# Altium schematic sheet can.SchDoc: MJVESC MINI - CAN
size A4; Author: Dongil Choi; Organization: DRC LAB, Myongji University; Address1: Engineering Building 1, #214; Address2: 116 Myongji-ro, Cheoin-Gu; Address3: Yongin-si, Gyeonggi-Do; Address4: South Korea, 17058; DocumentNumber: 3; Revision: 0.3A; SheetNumber: 3; SheetTotal: 3
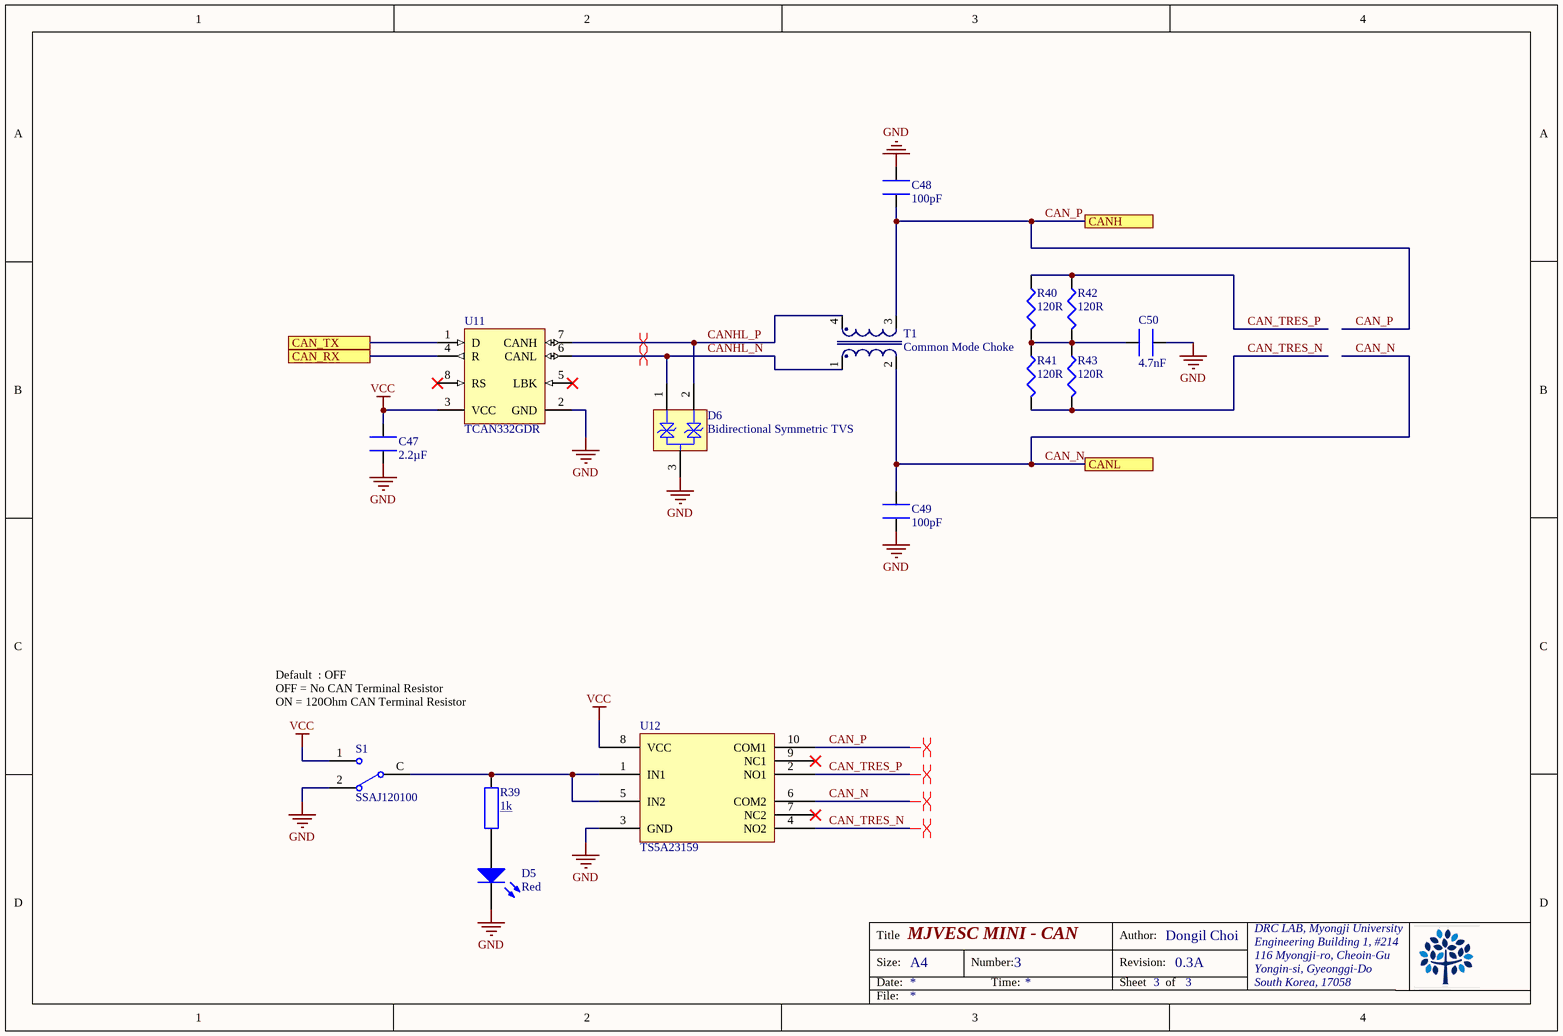
[diagram p0: can.SchDoc]

## Parts
C47  2.2µF  [CAP 0603/1608]
C48  100pF  [CAP 0402/1005]
C49  100pF  [CAP 0402/1005]
C50  4.7nF  [CAP 0603/1608]
D5  Red  [LED 0603/1608 RED]
D6  Bidirectional Symmetric TVS  [SOT23-3L]
R39  1k  [RES 0603/1608]
R40  120R  [RES 0603/1608]
R41  120R  [RES 0603/1608]
R42  120R  [RES 0603/1608]
R43  120R  [RES 0603/1608]
S1  SSAJ120100  [SSAJ120100]
T1  Common Mode Choke  [SRF4532-101Y]
U11  TCAN332GDR  [D0008A_N]
U12  TS5A23159  [RSE10]

## Ports
CAN_RX, CAN_TX, CANH, CANL

## Nets
GND: C47.1 C48.1 C49.2 C50.2 D5.2(K) D6.3(C) S1.2 U11.2(GND) U12.3(GND)
VCC: C47.2 S1.1 U11.3(VCC) U12.8(VCC)
CAN_N: C49.1 T1.2 U12.6(COM2) ; port CANL
CAN_P: C48.2 T1.3 U12.10(COM1) ; port CANH
CAN_RX: U11.4(R) ; port CAN_RX
CAN_TRES_N: R41.2 R43.2 U12.4(NO2)
CAN_TRES_P: R40.1 R42.1 U12.2(NO1)
CAN_TX: U11.1(D) ; port CAN_TX
CANHL_N: D6.1(C) T1.1 U11.6(CANL)
CANHL_P: D6.2(C) T1.4 U11.7(CANH)
NetC50_1: C50.1 R40.2 R41.1 R42.2 R43.1
NetD5_1: D5.1(A) R39.2
NetR39_1: R39.1 S1.C U12.1(IN1) U12.5(IN2)

Not connected (* = marked no-connect by the designer): U11 5(LBK)* 8(RS)*; U12 7(NC2)* 9(NC1)*

## Layout directives
differential pair: CAN_N, CAN_P, CAN_TRES_N, CAN_TRES_P, CANHL_N, CANHL_P

## Notes on the sheet
- Default  : OFF
  OFF = No CAN Terminal Resistor
  ON = 120Ohm CAN Terminal Resistor
- Title
- Size:
- Date:
- A4
- Number:
- Time:
- Revision:
- Sheet
- Author:
- of
- File:

## Library data of the parts
C47 = GRM188R61C225KE15D: CAP CER 2.2UF 16V X5R 0603; Manufacturer: Murata Electronics North America; Tolerance: ±10%; Supplier 1: Digi-Key; Supplier Part Number 1: 490-3296-1-ND; Manufacturer Part Number: GRM188R61C225KE15D; RoHS: RoHS Compliant; Category: Capacitors; Stock 1: 1255740; Pricing 1: 1=0.12, 10=0.08, 50=0.046, 100=0.038, 250=0.032, 500=0.0268, 1000=0.022 (USD); Packaging: Cut Tape (CT); Capacitance: 2.2µF; Voltage - Rated: 16V; Temperature Coefficient: X5R; Mounting Type: Surface Mount, MLCC; Operating Temperature: -55°C ~ 85°C; Applications: General Purpose; Ratings: -; Package / Case: 0603 (1608 Metric); Size / Dimension: 0.063" L x 0.031" W (1.60mm x 0.80mm); Height - Seated (Max): -; Thickness (Max): 0.035" (0.90mm); Lead Spacing: -; Features: -; Lead Style: -; ComponentLink1URL: http://www.murata.com/~/media/webrenewal/support/library/catalog/products/capacitor/mlcc/c02e.pdf; ComponentLink1Description: http://www.murata.com/~/media/webrenewal/support/library/catalog/products/capacitor/mlcc/c02e.pdf; PartNumber: GRM188R61C225KE15D
C48 C49 = GRM1885C1H222JA01D: CAP CER 100pF 50V NP0 0402; PartNumber: GRM1555C1H101GA01D
C50 = GRM1885C1H222JA01D: CAP CER 4.7nF 50V NP0 0603; PartNumber: GRM1887U1H472JA01D
D5 = LED0: Typical INFRARED GaAs LED; PartNumber: LTST-C191KRKT; Published: 8-Jun-2000; LatestRevisionDate: 08-Jul-2005; LatestRevisionNote: Mech Layer 1 removed.; PackageReference: LED-0; Publisher: Altium Limited; PackageDescription: LED; 2 Leads
D6 = ESD8V0L2B-03L: Bi-directional Low Capacitance TVS Diode, -55 to 125 degC, TSLP-3-1, Reel, Green; PartNumber: VCAN26A2-03S-E3-08
R39 = RC0603FR-071KL: RES SMD 1K OHM 1% 1/10W 0603; Manufacturer: Yageo; Power (Watts): 0.1W, 1/10W; Temperature Coefficient: ±100ppm/°C; Supplier 1: Digi-Key; Supplier Part Number 1: 311-1.00KHRCT-ND; RoHS: RoHS Compliant; Category: Resistors; Stock 1: 6734836; Pricing 1: 1=0.1, 10=0.014, 25=0.01, 100=0.0057, 250=0.00436, 500=0.00348, 1000=0.00257, 2500=0.00223 (USD); Packaging: Cut Tape (CT); Tolerance: ±1%; Composition: Thick Film; Features: Moisture Resistant; Operating Temperature: -55°C ~ 155°C; Package / Case: 0603 (1608 Metric); Supplier Device Package: 0603; Size / Dimension: 0.063" L x 0.031" W (1.60mm x 0.80mm); Height: 0.022" (0.55mm); Number of Terminations: 2; ComponentLink1URL: http://www.yageo.com/documents/recent/PYu-RC_Group_51_RoHS_L_04.pdf; ComponentLink1Description: http://www.yageo.com/documents/recent/PYu-RC_Group_51_RoHS_L_04.pdf; Manufacturer Part Number: RC0603FR-071KL; Resistance (Ohms): 1k; PartNumber: RC0603FR-071KL
R40-R43 = Res3: RES SMD 120R OHM 1% 1/10W 0603; PartNumber: RC0603FR-07120RL; Published: 8-Jun-2000; LatestRevisionDate: 29-May-2009; LatestRevisionNote: IPC-7351 Footprint Added.; PackageReference: J1-0603; Publisher: Altium Limited; PackageDescription: Chip Resistor; Value: 120R
S1 = SW-SPDT: SPDT Subminiature Toggle Switch, Right Angle Mounting, Vertical Actuation; Published: 24-Mar-1999; LatestRevisionDate: 17-Dec-2003; LatestRevisionNote: Schematic revised, PCB Footprint replaced.; DatasheetVersion: 05-Dec-2000; PackageReference: TL36WW15050; Publisher: Altium Limited; PackageDescription: Switch; 4 Leads; ComponentLink1Description: Manufacturer Link; ComponentLink1URL: http://www.apem.com; PartNumber: SSAJ120100
T1 = MID-D11, 070-5627: Dual Coil - Common Mode Choke, 4-Terminal, THT, MID-D11, Bobbin-070-5627; PartNumber: SRF4532-101Y
U11 = TCAN332GDR: 3.3V CAN Transceiver, 5Mbps; Manufacturer: Texas Instruments; Drivers Per Package: 1; Eco-Plan: Green (RoHS & no Sb/Br); Supply Voltage(s)(V): 3.3; Transient Pulse Protection(V): -100 to 100; PackageReference: D0008A; ComponentLink1Description: Datasheet; PackageDescription: 8-Pin Plastic Small Outline Integrated Circuit, 4.9 x 3.9 mm, Pitch 1.27 mm Pitch; SubFamily: CAN; ComponentLink1URL: http://www.ti.com/general/docs/lit/getliterature.tsp?genericPartNumber=SN65HVD233&fileType=pdf; PartNumber: TCAN332GDR; Mounting Technology: Surface Mount
U12 = TI TS5A23159: 1-Ω 2-Channel SPDT Analog Switch; PartNumber: TS5A23159RSER